# EAGLE design ASD2009 (EAGLE 6.3)
DATABASE: ./../../../../../Components/TinyCircuits_Part_Database.txt
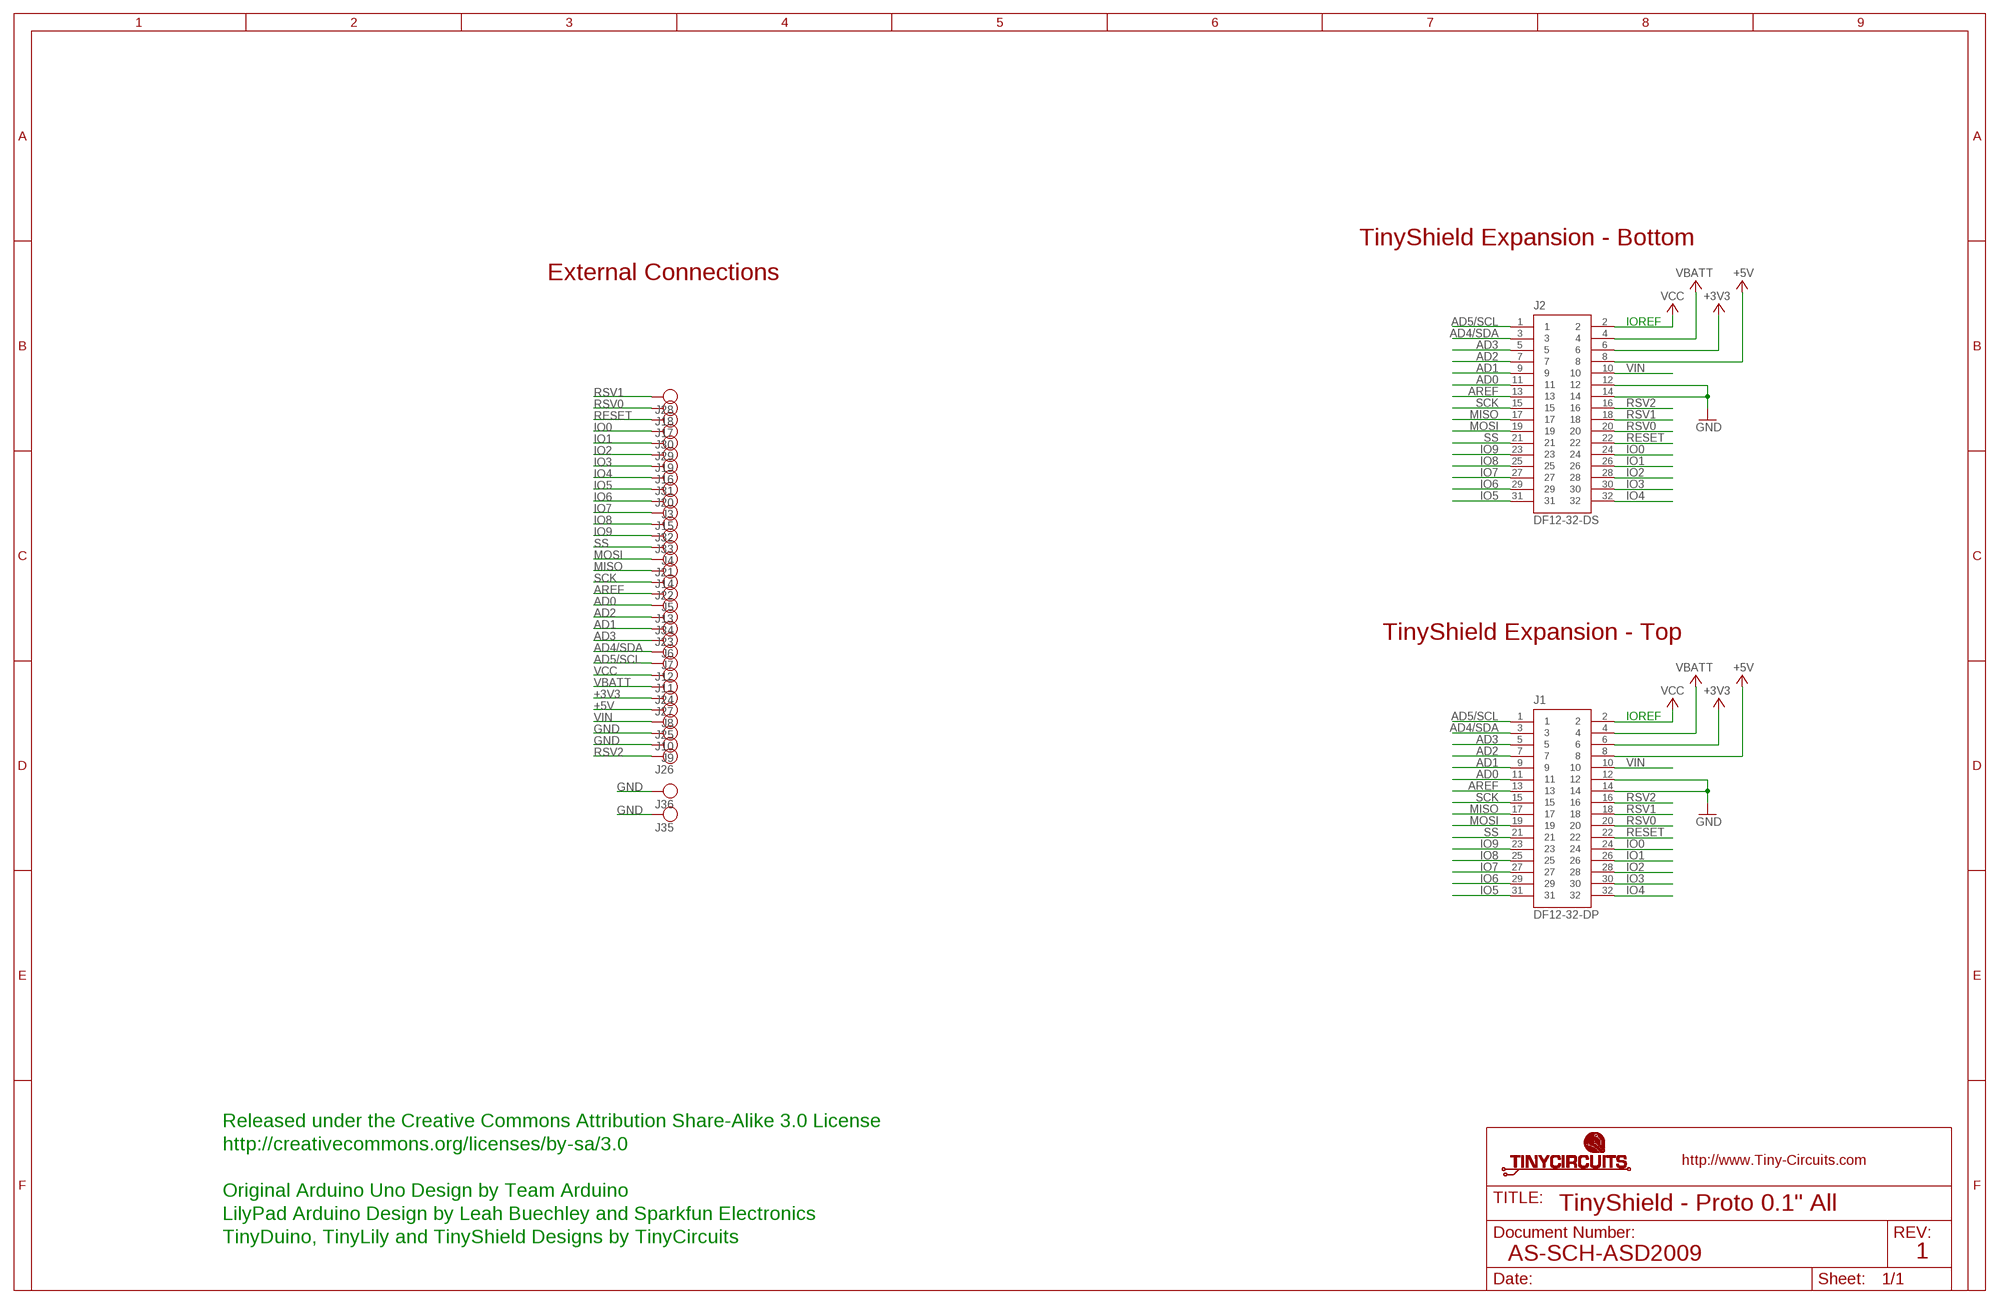
[diagram p0: schematic, sheet 1]

## Parts
J1  DF12-32-DP  AS-ITM-00015  [DF12-32-DP]
J2  DF12-32-DS  AS-ITM-00012  [DF12-32-DS]
J3  PIN_1X.1"1  [1X.1"_2]
J4  PIN_1X.1"1  [1X.1"_2]
J5  PIN_1X.1"1  [1X.1"_2]
J6  PIN_1X.1"1  [1X.1"_2]
J7  PIN_1X.1"1  [1X.1"_2]
J8  PIN_1X.1"1  [1X.1"_2]
J9  PIN_1X.1"1  [1X.1"_2]
J10  PIN_1X.1"1  [1X.1"_2]
J11  PIN_1X.1"1  [1X.1"_2]
J12  PIN_1X.1"1  [1X.1"_2]
J13  PIN_1X.1"1  [1X.1"_2]
J14  PIN_1X.1"1  [1X.1"_2]
J15  PIN_1X.1"1  [1X.1"_2]
J16  PIN_1X.1"1  [1X.1"_2]
J17  PIN_1X.1"1  [1X.1"_2]
J18  PIN_1X.1"1  [1X.1"_2]
J19  PIN_1X.1"1  [1X.1"_2]
J20  PIN_1X.1"1  [1X.1"_2]
J21  PIN_1X.1"1  [1X.1"_2]
J22  PIN_1X.1"1  [1X.1"_2]
J23  PIN_1X.1"1  [1X.1"_2]
J24  PIN_1X.1"1  [1X.1"_2]
J25  PIN_1X.1"1  [1X.1"_2]
J26  PIN_1X.1"1  [1X.1"_2]
J27  PIN_1X.1"1  [1X.1"_2]
J28  PIN_1X.1"1  [1X.1"_2]
J29  PIN_1X.1"1  [1X.1"_2]
J30  PIN_1X.1"1  [1X.1"_2]
J31  PIN_1X.1"1  [1X.1"_2]
J32  PIN_1X.1"1  [1X.1"_2]
J33  PIN_1X.1"1  [1X.1"_2]
J34  PIN_1X.1"1  [1X.1"_2]
J35  PIN_1X.1"1  [1X.1"_2]
J36  PIN_1X.1"1  [1X.1"_2]

## Nets
+3V3: J1.6 J2.6 J27.1
+5V: J1.8 J2.8 J8.1
AD0: J1.11 J2.11 J13.1
AD1: J1.9 J2.9 J23.1
AD2: J1.7 J2.7 J34.1
AD3: J1.5 J2.5 J6.1
AD4/SDA: J1.3 J2.3 J7.1
AD5/SCL: J1.1 J2.1 J12.1
AREF: J1.13 J2.13 J5.1
GND: J1.12 J1.14 J2.12 J2.14 J9.1 J10.1 J35.1 J36.1
IO0: J1.24 J2.24 J30.1
IO1: J1.26 J2.26 J29.1
IO2: J1.28 J2.28 J19.1
IO3: J1.30 J2.30 J16.1
IO4: J1.32 J2.32 J31.1
IO5: J1.31 J2.31 J20.1
IO6: J1.29 J2.29 J3.1
IO7: J1.27 J2.27 J15.1
IO8: J1.25 J2.25 J32.1
IO9: J1.23 J2.23 J33.1
MISO: J1.17 J2.17 J14.1
MOSI: J1.19 J2.19 J21.1
RESET: J1.22 J2.22 J17.1
RSV0: J1.20 J2.20 J18.1
RSV1: J1.18 J2.18 J28.1
RSV2: J1.16 J2.16 J26.1
SCK: J1.15 J2.15 J22.1
SS: J1.21 J2.21 J4.1
VBATT: J1.4 J2.4 J24.1
VCC: J1.2 J2.2 J11.1
VIN: J1.10 J2.10 J25.1

## Notes on the sheet
- TinyShield Expansion - Bottom
- External Connections
- IOREF
- TinyShield Expansion - Top
- IOREF
- Released under the Creative Commons Attribution Share-Alike 3.0 License
- http://creativecommons.org/licenses/by-sa/3.0
- Original Arduino Uno Design by Team Arduino
- TinyShield - Proto 0.1" All
- LilyPad Arduino Design by Leah Buechley and Sparkfun Electronics
- TinyDuino, TinyLily and TinyShield Designs by TinyCircuits
- AS-SCH-ASD2009 | 1

## Library data of the parts
J1 = tinycircuits:AS-ITM-00015: CONN HEADER 32POS 3MM SMD 0.5MM; PARTNO: AS-ITM-00015
J2 = tinycircuits:AS-ITM-00012: CONN RECEPT 32POS 3MM SMD 0.5MM; PARTNO: AS-ITM-00012
J3-J36 = tinycircuits:PIN_1X.1": 1 Pin 0.100" Header

## Board
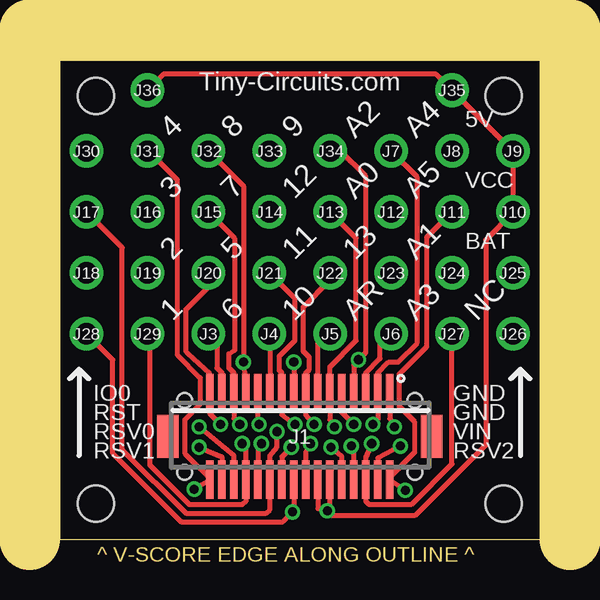
[diagram p1: board, top side]
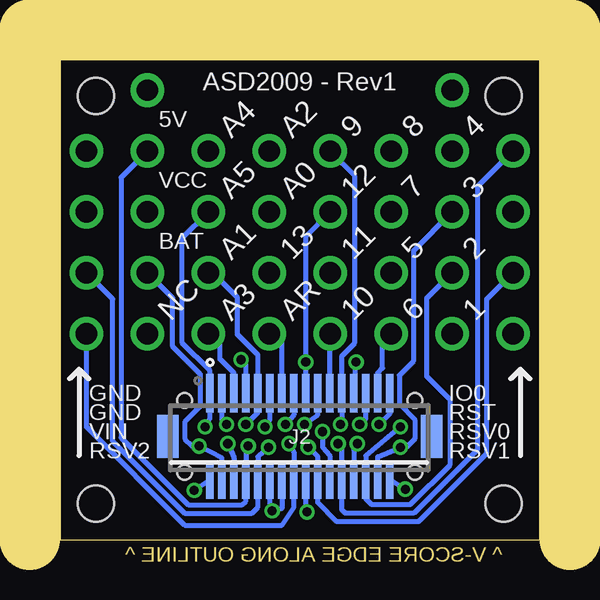
[diagram p2: board, bottom side, seen from below]

Size 20 x 20 mm. Coordinates in mm from the lower left corner, seen from the top.
Outline: 0,20 20,20 20,0 0,0 0,20
Copper layers (1*16): Top 0.035mm / dielectric 1.5mm / Bottom 0.035mm
Design rules "default *": minimum track width 5mil, minimum drill 15mil, track to track 5mil, track to pad 5mil, pad to pad 5mil, via to via 6mil, smd to smd 5mil, copper to edge 6mil, drill to drill 8mil, minimum pad ring 10mil, minimum via ring 5mil, stop-mask expansion 4mil, vias tented up to drill 25mil, thermal gap 10mil
Holes 1.5 mm at 1.5,18.5 18.5,18.5 18.5,1.5 1.5,1.5
tRestrict: 1 lines
bRestrict: 1 lines
Milling: 3 lines

### Footprints (pad centres in the part's own frame; a part is rotated, then mirrored left to right if it is on the bottom)
DF12-32-DP = smd 0.3 x 1.6: 1 -3.75,-1.8; 2 -3.75,1.8; 3 -3.25,-1.8; 4 -3.25,1.8; 5 -2.75,-1.8; 6 -2.75,1.8; 7 -2.25,-1.8; 8 -2.25,1.8; 9 -1.75,-1.8; 10 -1.75,1.8; 11 -1.25,-1.8; 12 -1.25,1.8; 13 -0.75,-1.8; 14 -0.75,1.8; 15 -0.25,-1.8; 16 -0.25,1.8; 17 0.25,-1.8; 18 0.25,1.8; 19 0.75,-1.8; 20 0.75,1.8; 21 1.25,-1.8; 22 1.25,1.8; 23 1.75,-1.8; 24 1.75,1.8; 25 2.25,-1.8; 26 2.25,1.8; 27 2.75,-1.8; 28 2.75,1.8; 29 3.25,-1.8; 30 3.25,1.8; 31 3.75,-1.8; 32 3.75,1.8 | smd 0.9 x 1.8: F1 -5.5,0; F2 5.5,0 | hole 0.6: -4.8,1.5; 4.8,1.5
DF12-32-DS = smd 0.3 x 1.6: 1 -3.75,1.8; 2 -3.75,-1.8; 3 -3.25,1.8; 4 -3.25,-1.8; 5 -2.75,1.8; 6 -2.75,-1.8; 7 -2.25,1.8; 8 -2.25,-1.8; 9 -1.75,1.8; 10 -1.75,-1.8; 11 -1.25,1.8; 12 -1.25,-1.8; 13 -0.75,1.8; 14 -0.75,-1.8; 15 -0.25,1.8; 16 -0.25,-1.8; 17 0.25,1.8; 18 0.25,-1.8; 19 0.75,1.8; 20 0.75,-1.8; 21 1.25,1.8; 22 1.25,-1.8; 23 1.75,1.8; 24 1.75,-1.8; 25 2.25,1.8; 26 2.25,-1.8; 27 2.75,1.8; 28 2.75,-1.8; 29 3.25,1.8; 30 3.25,-1.8; 31 3.75,1.8; 32 3.75,-1.8 | smd 0.9 x 1.8: F1 -5.5,0; F2 5.5,0 | hole 0.6: -4.8,1.5; 4.8,1.5
1X.1"_2 = drill 0.889 pad 1.397: 1 0,0

### Placement (x,y rotation side)
J1  10,4.3 180 top
J2  10,4.3 0 bottom
J3  6.19,8.58 0 top
J4  8.73,8.58 0 top
J5  11.27,8.58 0 top
J6  13.81,8.58 0 top
J7  13.81,16.2 0 top
J8  16.35,16.2 0 top
J9  18.89,16.2 0 top
J10  18.89,13.66 0 top
J11  16.35,13.66 0 top
J12  13.81,13.66 0 top
J13  11.27,13.66 0 top
J14  8.73,13.66 0 top
J15  6.19,13.66 0 top
J16  3.65,13.66 0 top
J17  1.11,13.66 0 top
J18  1.11,11.12 0 top
J19  3.65,11.12 0 top
J20  6.19,11.12 0 top
J21  8.73,11.12 0 top
J22  11.27,11.12 0 top
J23  13.81,11.12 0 top
J24  16.35,11.12 0 top
J25  18.89,11.12 0 top
J26  18.89,8.58 0 top
J27  16.35,8.58 0 top
J28  1.11,8.58 0 top
J29  3.65,8.58 0 top
J30  1.11,16.2 0 top
J31  3.65,16.2 0 top
J32  6.19,16.2 0 top
J33  8.73,16.2 0 top
J34  11.27,16.2 0 top
J35  16.35,18.74 0 top
J36  3.65,18.74 0 top
U$1  [DOCFIELD-TINYCIRCUITS-PCB]  33.91,-10 0 top  (outside the outline)

### Tracks (layer width: path | path; a pad name or v marks a point on that pad's centre or on a via)
+3V3  (via drill 0.38)
  Top 0.203: v13,4 12.75,3.4 J2.6 12.75,1.6 12.9,1.45 14.65,1.45 16.35,3.15 J27.1
  Bottom 0.203: v13,4 12.75,3.4 J2.6
+5V  (via drill 0.38)
  Top 0.203: J2.8 12.25,3.8 v12.15,3.9
  Top 0.254: J2.8
  Bottom 0.203: v12.15,3.9 12.25,3.8 J2.8 12.25,1.6 12.4,1.45 14.65,1.45 17.45,4.25 17.45,15.1 J8.1
AD0  (via drill 0.38)
  Top 0.203: v11.45,4.7 11.25,5 J2.11 11.25,7.2 12.35,8.3 12.35,12.58 J13.1
  Bottom 0.203: v11.45,4.7 11.25,5 J2.11
AD1  (via drill 0.38)
  Top 0.203: J2.9 11.75,5.3 v12.25,4.8
  Bottom 0.203: v12.25,4.8 11.75,5.3 J2.9 11.75,7.7 12.6,8.55 12.6,10.1 13.62,11.12 J23.1
AD2  (via drill 0.38)
  Top 0.203: J2.7 12.25,7.3 v12.45,7.5 12.75,7.8 12.75,15.15 11.7,16.2 J34.1
  Bottom 0.203: J2.7 12.25,7.3 v12.45,7.5
AD3
  Top 0.203: J6.1 13.48,8.73 13.35,8.7 13.35,7.55 12.75,6.95 J2.5
  Bottom 0.203: J2.5 12.75,6.95 13.33,7.53 13.33,8.73 J6.1
AD4/SDA  (via drill 0.38)
  Top 0.203: v13.05,4.8 13.25,5 J2.3 13.25,6.95 13.7,7.4 14.1,7.4 14.9,8.2 14.9,15.11 J7.1
  Bottom 0.203: v13.05,4.8 13.25,5 J2.3
AD5/SCL  (via drill 0.38)
  Top 0.203: J2.1 13.75,5.05 v13.95,4.7
  Bottom 0.203: v13.95,4.7 13.75,5.05 J2.1 13.75,7.05 14.9,8.2 14.9,12.57 J12.1
AREF
  Top 0.203: J5.1 10.75,8.21 J2.13
  Bottom 0.203: J2.13 10.75,8.21 J5.1
GND  (via drill 0.38)
  Top 0.203: J2.14 10.75,1.3 v11.15,1.2 | v11.15,1.2 11.25,1.3 J2.12 | v11.15,1.2 11.35,1 14.8,1 17.75,3.95 17.75,12.5 18.89,13.64 J10.1 J9.1 J35.1 15.69,19.4 4.31,19.4 J36.1
  Bottom 0.203: J2.14 10.75,1.3 v11.15,1.2 11.25,1.3 J2.12
IO0  (via drill 0.38)
  Top 0.203: v8.4,4 8.25,3.85 J2.24
  Bottom 0.203: v8.4,4 8.25,3.85 J2.24 8.25,1.25 8.1,1.1 5.25,1.1 2.6,3.75 2.6,14.71 J30.1
  Bottom 0.254: J2.24
IO1  (via drill 0.38)
  Top 0.203: v7.6,4 7.75,3.75 J2.26 7.75,1.6 7.6,1.45 5.4,1.45 3.75,3.1 3.75,8.48 J29.1
  Bottom 0.203: v7.6,4 7.75,3.75 J2.26
IO2  (via drill 0.38)
  Top 0.203: J2.28 7.25,3.5 v5.8,4.7
  Bottom 0.203: v5.8,4.7 7.25,3.5 J2.28 7.25,1.7 7,1.45 5.4,1.45 3.75,3.1 3.75,5.85 4.7,6.8 4.7,10.07 J19.1
IO3  (via drill 0.38)
  Top 0.203: v5.8,3.85 6.75,3.45 J2.30
  Bottom 0.203: J2.30 6.75,3.45 v5.8,3.85 5.55,3.85 5.2,4.2 5.2,5 5.85,5.65 5.85,6.85 5.25,7.45 5.25,12.06 J16.1
IO4  (via drill 0.38)
  Top 0.203: v5.6,2.1 J2.32 6.25,2.55 5.2,3.6 5.2,5 5.85,5.65 5.85,6.75 4.9,7.7 4.9,15 3.7,16.2 J31.1
  Bottom 0.203: v5.6,2.1 J2.32
IO5  (via drill 0.38)
  Top 0.203: v6.7,4.8 6.25,5.25 J2.31 6.25,6.9 5.35,7.75 5.25,7.85 5.25,9.6 6.19,10.54 J20.1
  Bottom 0.203: J2.31 6.25,5.25 v6.7,4.8
IO6
  Top 0.203: J3.1 6.55,8.37 6.55,7.15 6.75,6.95 J2.29
  Top 0.254: J2.29
  Bottom 0.203: J2.29 6.75,6.95 6.55,7.15 6.55,8.37 J3.1
IO7  (via drill 0.38)
  Top 0.203: v7.5,4.8 7.25,5.05 J2.27 7.25,6.95 7.05,7.15 7.05,7.75 7.3,7.9 7.3,12.55 J15.1
  Bottom 0.203: v7.5,4.8 7.25,5.05 J2.27
IO8  (via drill 0.38)
  Top 0.203: J2.25 v7.65,7.4 7.65,14.74 J32.1
  Bottom 0.203: J2.25 v7.65,7.4
IO9  (via drill 0.38)
  Top 0.203: v8.3,4.8 8.25,4.85 J2.23
  Bottom 0.203: v8.3,4.8 8.25,4.85 J2.23 8.25,7.65 7.7,8.2 7.7,15.15 8.73,16.18 J33.1
MISO  (via drill 0.38)
  Top 0.203: v9.75,7.4 J2.17
  Bottom 0.203: J2.17 v9.75,7.4 9.75,12.64 J14.1
MOSI  (via drill 0.38)
  Top 0.203: v9.8,4.8 9.25,5.2 J2.19 9.25,6.95 9.15,7.05 9.15,7.65 9.8,8.3 9.8,10.05 J21.1
  Bottom 0.203: v9.8,4.8 9.25,5.2 J2.19
RESET  (via drill 0.38)
  Top 0.203: v9.05,4.5 9.05,3.85 8.75,3.5 J2.22 8.75,1.25 8.6,1.1 5.25,1.1 2.6,3.75 2.6,12.17 J17.1
  Bottom 0.203: v9.05,4.5 9.05,3.85 8.75,3.5 J2.22
RSV0  (via drill 0.38)
  Top 0.203: v9.65,3.85 9.25,3.45 J2.20
  Bottom 0.203: v9.65,3.85 9.25,3.45 J2.20 9.25,1.55 8.45,0.75 5.05,0.75 2.2,3.6 2.2,10.03 J18.1
RSV1  (via drill 0.38)
  Top 0.203: J2.18 9.75,1 v9.7,1.15 9.3,0.75 5.05,0.75 2.2,3.6 2.2,7.49 J28.1
  Bottom 0.203: v9.7,1.15 9.75,1 J2.18
RSV2  (via drill 0.38)
  Top 0.203: J2.16 10.25,3.65 v10.45,4
  Bottom 0.203: v10.45,4 10.25,3.65 J2.16 10.25,1.35 10.75,0.6 14.8,0.6 18.89,4.69 J26.1
SCK  (via drill 0.38)
  Top 0.203: v10.6,4.8 10.25,5.2 J2.15 10.25,6.95 10.4,7.1 10.4,7.6 10.15,7.85 10.15,9.7 11.27,10.82 J22.1
  Bottom 0.203: J2.15 10.25,5.2 v10.6,4.8
SS
  Top 0.203: J4.1 8.75,8.71 J2.21
  Bottom 0.203: J2.21 8.73,6.12 J4.1
VBATT  (via drill 0.38)
  Top 0.203: v14.2,3.9 13.25,3.4 J2.4
  Bottom 0.203: J2.4 13.25,3.4 v14.2,3.9 14.5,3.9 14.8,4.2 14.8,4.9 14.15,5.55 14.15,6.9 15.3,8.05 15.3,10.07 J24.1
VCC  (via drill 0.38)
  Top 0.203: v14.4,2.05 J2.2 13.75,2.6 | 13.75,2.9 13.75,2.6 | 13.75,2.6 14.8,3.65 14.8,4.9 14.15,5.55 14.15,6.9 15.3,8.05 15.3,12.61 J11.1
  Bottom 0.203: v14.4,2.05 J2.2
VIN  (via drill 0.38)
  Top 0.203: J2.10 11.75,3.45 v11.3,3.85
  Bottom 0.203: v11.3,3.85 11.75,3.45 J2.10 11.75,1.35 12,1.1 14.8,1.1 17.8,4.1 17.8,10.03 J25.1

### Text on the board
Dimension: ^ V-SCORE EDGE ALONG OUTLINE ^
tPlace: Tiny-Circuits.com | 4 | 8 | 9 | A2 | A4 | 5V | VCC | 3 | 7 | 12 | A0 | A5 | 2 | 5 | 11 | 13 | A1 | BAT | 1 | 6 | 10 | AR | A3 | NC | IO0 | GND | RST | GND | RSV0 | VIN | RSV1 | RSV2
bPlace: ASD2009 - Rev1 | 4 | 8 | 9 | A2 | A4 | 5V | VCC | 3 | 7 | 12 | A0 | A5 | 2 | 5 | 11 | 13 | A1 | BAT | 1 | 6 | 10 | AR | A3 | NC | IO0 | GND | RST | GND | RSV0 | VIN | RSV1 | RSV2
Document: FABRICATION DRAWING | NOTES: | 1. PRINTED CIRCUIT BOARD MADE FROM NEMA GRADE FR-4 EPOXY LAMINATE | WITH 1 OUNCE COPPER PLATING AND .024 THICKNESS. | 2. ALL DIMENSIONS ARE GIVEN IN INCHES. | 3. CIRCUIT PATHS ARE FOR REFERENCE ONLY. | 4. HOLE SIZES SHOWN ARE FINISHED DIAMETERS AFTER PLATING. | 5. BOARD PLATED USING REFLOW OR SIMILAR METHOD. | 6. BOARD TO HAVE BLUE SOLDER MASK ON PLATED SURFACES USING WET FILM | 7. SILKSCREEN BOARD USING WHITE INK. | SR100 OR SR1010 EPOXY. EQUIVALENT WET OR DRY FILM MAY BE USED. | 8. THE FOLLOWING INFORMATION APPLIES TO THIS BOARD: | * 2 COPPER LAYERS | * .024 BOARD THICKNESS | * REQUIRES TOP SIDE SILKSCREEN | Released under the Creative Commons Attribution Share-Alike 3.0 License | http://creativecommons.org/licenses/by-sa/3.0 | Original Arduino Uno Design by Team Arduino | LilyPad Arduino Design by Leah Buechley and Sparkfun Electronics | TinyDuino, TinyLily and TinyShield Designs by TinyCircuits | TinyShield - Proto 0.1" All | AS-PCB-ASD2009 | 1